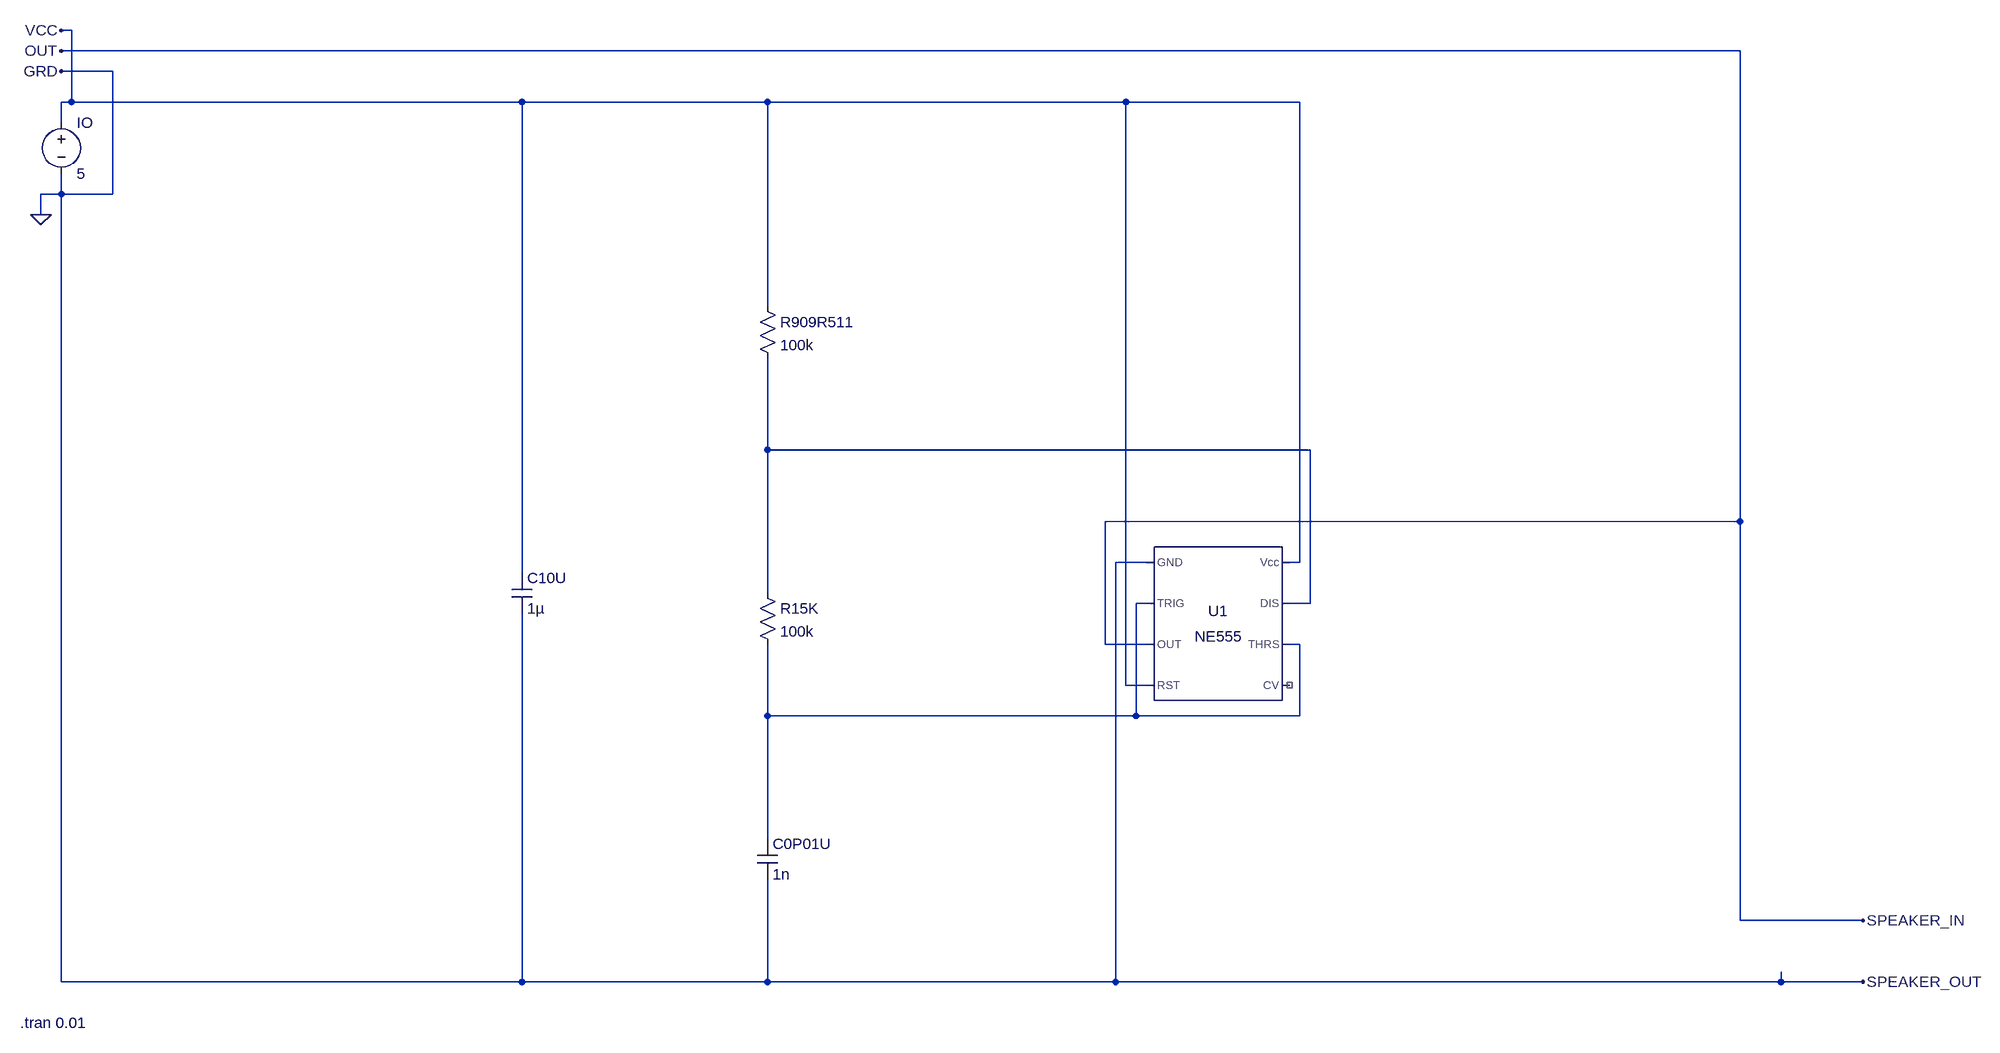
[diagram p0: schematic Draft1.asc]
Draft1.asc, the LTspice schematic file:
Version 4
SHEET 1 5052 1040
WIRE -992 -528 -1008 -528
WIRE 1616 -496 -1008 -496
WIRE -928 -464 -1008 -464
WIRE -992 -416 -992 -528
WIRE -992 -416 -1008 -416
WIRE -288 -416 -992 -416
WIRE 96 -416 -288 -416
WIRE 656 -416 96 -416
WIRE 928 -416 656 -416
WIRE -1008 -384 -1008 -416
WIRE -1008 -272 -1008 -304
WIRE -1008 -272 -1040 -272
WIRE -928 -272 -928 -464
WIRE -928 -272 -1008 -272
WIRE -1040 -240 -1040 -272
WIRE 96 -96 96 -416
WIRE 96 128 96 -16
WIRE 944 128 96 128
WIRE 1616 240 1616 -496
WIRE 1616 240 624 240
WIRE 688 304 640 304
WIRE 928 304 928 -416
WIRE 928 304 912 304
WIRE -288 320 -288 -416
WIRE 96 352 96 128
WIRE 688 368 672 368
WIRE 944 368 944 128
WIRE 944 368 912 368
WIRE 624 432 624 240
WIRE 688 432 624 432
WIRE 928 432 912 432
WIRE 656 496 656 -416
WIRE 688 496 656 496
WIRE 96 544 96 432
WIRE 672 544 672 368
WIRE 672 544 96 544
WIRE 928 544 928 432
WIRE 928 544 672 544
WIRE 96 736 96 544
WIRE 1616 864 1616 240
WIRE 1808 864 1616 864
WIRE -1008 960 -1008 -272
WIRE -288 960 -288 384
WIRE -288 960 -1008 960
WIRE 96 960 96 800
WIRE 96 960 -288 960
WIRE 640 960 640 304
WIRE 640 960 96 960
WIRE 1680 960 1680 944
WIRE 1680 960 640 960
WIRE 1808 960 1680 960
FLAG -1040 -240 0
FLAG 1808 864 SPEAKER_IN
FLAG -1008 -496 OUT
FLAG -1008 -528 VCC
FLAG -1008 -464 GRD
FLAG 1808 960 SPEAKER_OUT
SYMBOL res 80 -112 R0
SYMATTR InstName R909R511
SYMATTR Value 100k
SYMBOL cap 80 736 R0
SYMATTR InstName C0P01U
SYMATTR Value 1n
SYMBOL Misc\\NE555 800 400 R0
SYMATTR InstName U1
SYMBOL cap -304 320 R0
SYMATTR InstName C10U
SYMATTR Value 1µ
SYMBOL res 80 336 R0
SYMATTR InstName R15K
SYMATTR Value 100k
SYMBOL voltage -1008 -400 R0
WINDOW 123 0 0 Left 0
WINDOW 39 0 0 Left 0
SYMATTR InstName IO
SYMATTR Value 5
TEXT -1072 1024 Left 2 !.tran 0.01

The netlist it stands for:
* Draft1.asc
R909R511 VCC N001 100k
C0P01U N002 0 1n
XU1 0 N002 OUT VCC NC_01 N002 N001 VCC NE555  ; pins GND TRIG OUT RST CV THRS DIS Vcc
C10U VCC 0 1µ
R15K N001 N002 100k
V§IO VCC 0 5
.tran 0.01
.lib NE555.sub
.backanno
.end